# EAGLE design DSP_Lab_SS21_Keyboard_V2 (EAGLE 9.6.2)
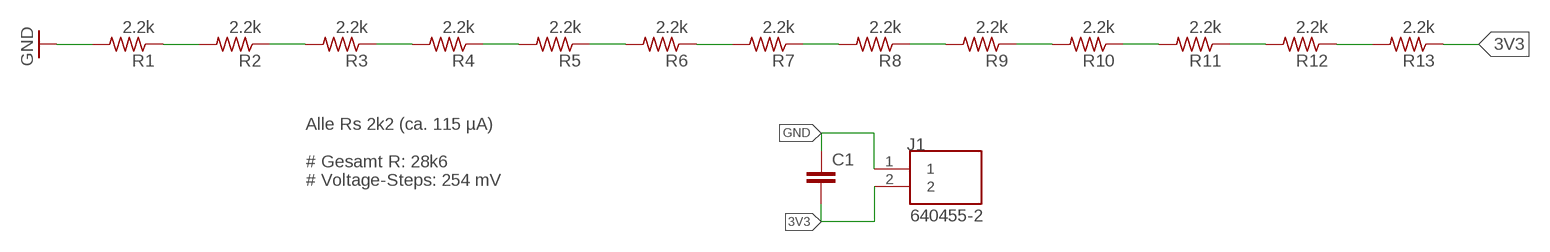
[diagram p0: schematic, sheet 1]

## Parts
C1  C-EUC0603  [C0603]
J1  640455-2  [TE_640455-2]
R1  2.2k  R-US_R0603  [R0603]
R2  2.2k  R-US_R0603  [R0603]
R3  2.2k  R-US_R0603  [R0603]
R4  2.2k  R-US_R0603  [R0603]
R5  2.2k  R-US_R0603  [R0603]
R6  2.2k  R-US_R0603  [R0603]
R7  2.2k  R-US_R0603  [R0603]
R8  2.2k  R-US_R0603  [R0603]
R9  2.2k  R-US_R0603  [R0603]
R10  2.2k  R-US_R0603  [R0603]
R11  2.2k  R-US_R0603  [R0603]
R12  2.2k  R-US_R0603  [R0603]
R13  2.2k  R-US_R0603  [R0603]

## Nets
3V3: C1.2 J1.2 R13.1
GND: C1.1 J1.1 R1.2
STEP1: R1.1 R2.2
STEP2: R2.1 R3.2
STEP3: R3.1 R4.2
STEP4: R4.1 R5.2
STEP5: R5.1 R6.2
STEP6: R6.1 R7.2
STEP7: R7.1 R8.2
STEP8: R8.1 R9.2
STEP9: R9.1 R10.2
STEP10: R10.1 R11.2
STEP11: R11.1 R12.2
STEP12: R12.1 R13.2

## Notes on the sheet
- Alle Rs 2k2 (ca. 115 µA)
  
  # Gesamt R: 28k6
  # Voltage-Steps: 254 mV

## Library data of the parts
C1 = rcl:C-EU: CAPACITOR, European symbol; SPICEPREFIX: C
J1 = 640455-2:640455-2; AVAILABILITY: Unavailable; COMMENT: 640455-2; DESCRIPTION: MTA-100 2 Position 2.54 mm Single Row Right Angle Wire to Board Header; EU_ROHS_COMPLIANCE: Compliant; MF: TE Connectivity; MP: 640455-2; PACKAGE: None; PRICE: None; TE_PURCHASE_URL: https://www.te.com/usa-en/product-640455-2.html?te_bu=Cor&te_type=disp&te_campaign=seda_glo_cor-seda-global-disp-prtnr-fy19-seda-model-bom-cta_sma-317_1&elqCampaignId=32493
R1-R13 = rcl:R-US_: RESISTOR, American symbol

## Board
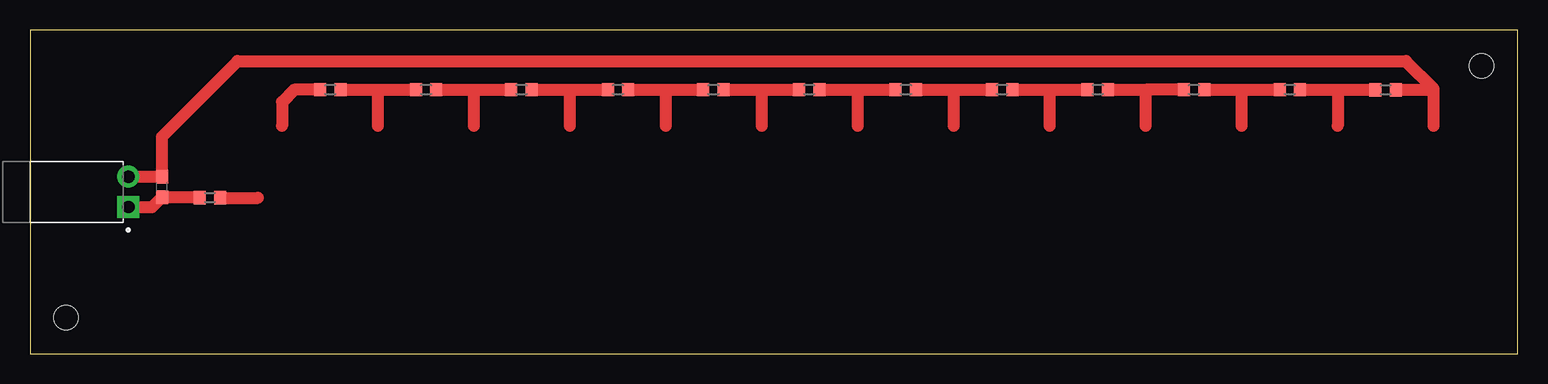
[diagram p1: board, top side]

Size 124 x 27 mm. Coordinates in mm from the lower left corner, seen from the top.
Outline: 0,0 124,0 124,27 0,27 0,0
Copper layers (1*16): Top 0.035mm / dielectric 1.5mm / Bottom 0.035mm
Design rules "Projektlabor_THT_DRC_2019": minimum track width 0.8mm, minimum drill 0.6mm, track to track 15mil, track to pad 12mil, pad to pad 16mil, via to via 20mil, smd to smd 8mil, copper to edge 40mil, drill to drill 16mil, minimum pad ring 16mil, minimum via ring 14mil, stop-mask expansion 4mil, vias tented up to drill 0mil, thermal gap 15mil
Holes 2 mm at 3,3 121,24

### Footprints (pad centres in the part's own frame; a part is rotated, then mirrored left to right if it is on the bottom)
C0603 = smd 1.1 x 1: 1 -0.85,0; 2 0.85,0
TE_640455-2 = drill 1.02 pad 1.37 square: 1 0,0 | drill 1.02 pad 1.37: 2 -2.54,0
R0603 = smd 1 x 1.1: 1 -0.85,0; 2 0.85,0

### Placement (x,y rotation side)
C1  11,13.9 90 top
J1  8.2,12.22 270 top
R1  15,13 180 top
R2  25.03,22.02 180 top
R3  33.02,22.02 180 top
R4  40.97,22.02 180 top
R5  49.02,22.02 180 top
R6  56.97,22.02 180 top
R7  64.96,22.02 180 top
R8  73.01,22.02 180 top
R9  81.03,22.02 180 top
R10  89.01,22.02 180 top
R11  97.03,22.02 180 top
R12  105.02,22.02 180 top
R13  113,22 180 top

### Tracks (layer width: path | path; a pad name or v marks a point on that pad's centre or on a via)
3V3
  Top 0.813: C1.2
  Top 1.016: 117,19 117,22.1 | 117,22.1 114.7,24.4 17.3,24.4 11,18.1 C1.2 | J1.2 C1.2 | 117,22.1 116.9,22 R13.1
GND
  Top 0.813: 11.95,13.05 12,13
  Top 1.016: J1.1 10.17,12.22 C1.1 | C1.1 11.95,13.05 | C1.1 14.1,13.05 R1.2
STEP1
  Top 1.016: R1.1 19,13 | R2.2 22.02,22.02 21,21 21,19
STEP2
  Top 1.016: R2.1 29,22.02 | 29,19 29,22.02 | 29,22.02 R3.2
STEP3
  Top 1.016: R3.1 37,22.02 | 37,19 37,22.02 | 37,22.02 R4.2
STEP4
  Top 1.016: R4.1 45,22.02 | 45,19 45,22.02 | 45,22.02 R5.2
STEP5
  Top 1.016: R5.1 53,22.02 | 53,19 53,22.02 | 53,22.02 R6.2
STEP6
  Top 1.016: R6.1 61,22.02 | 61,19 61,22.02 | 61,22.02 R7.2
STEP7
  Top 1.016: R7.1 69,22.02 | 69,19 69,22.02 | 69,22.02 R8.2
STEP8
  Top 1.016: R8.1 77,22.02 | 77,22.02 R9.2 | 77,19 77,22.02
STEP9
  Top 1.016: R9.1 85,22.02 | 85,22.02 R10.2 | 85,19 85,22.02
STEP10
  Top 1.016: R10.1 93,22.02 | 93,19 93,22.02 | R11.2 93,22.02
STEP11
  Top 1.016: R11.1 101,22.02 | 101,22.02 R12.2 | 101,19 101,22.02
STEP12
  Top 1.016: R12.1 109,22.02 | 109,22.02 112.13,22.02 R13.2 | 109,22.02 109,19

### Text on the board
PRINT: Body-Synth / Keyboard V2 / DSP-Lab SS21